# Altium schematic sheet 0_architecture.schdoc: Hardware Archictecture
size A4; Revision: v0.1; SheetNumber: 0; SheetTotal: 6; Designed by: André M. P. Mattos; Version: v0.1
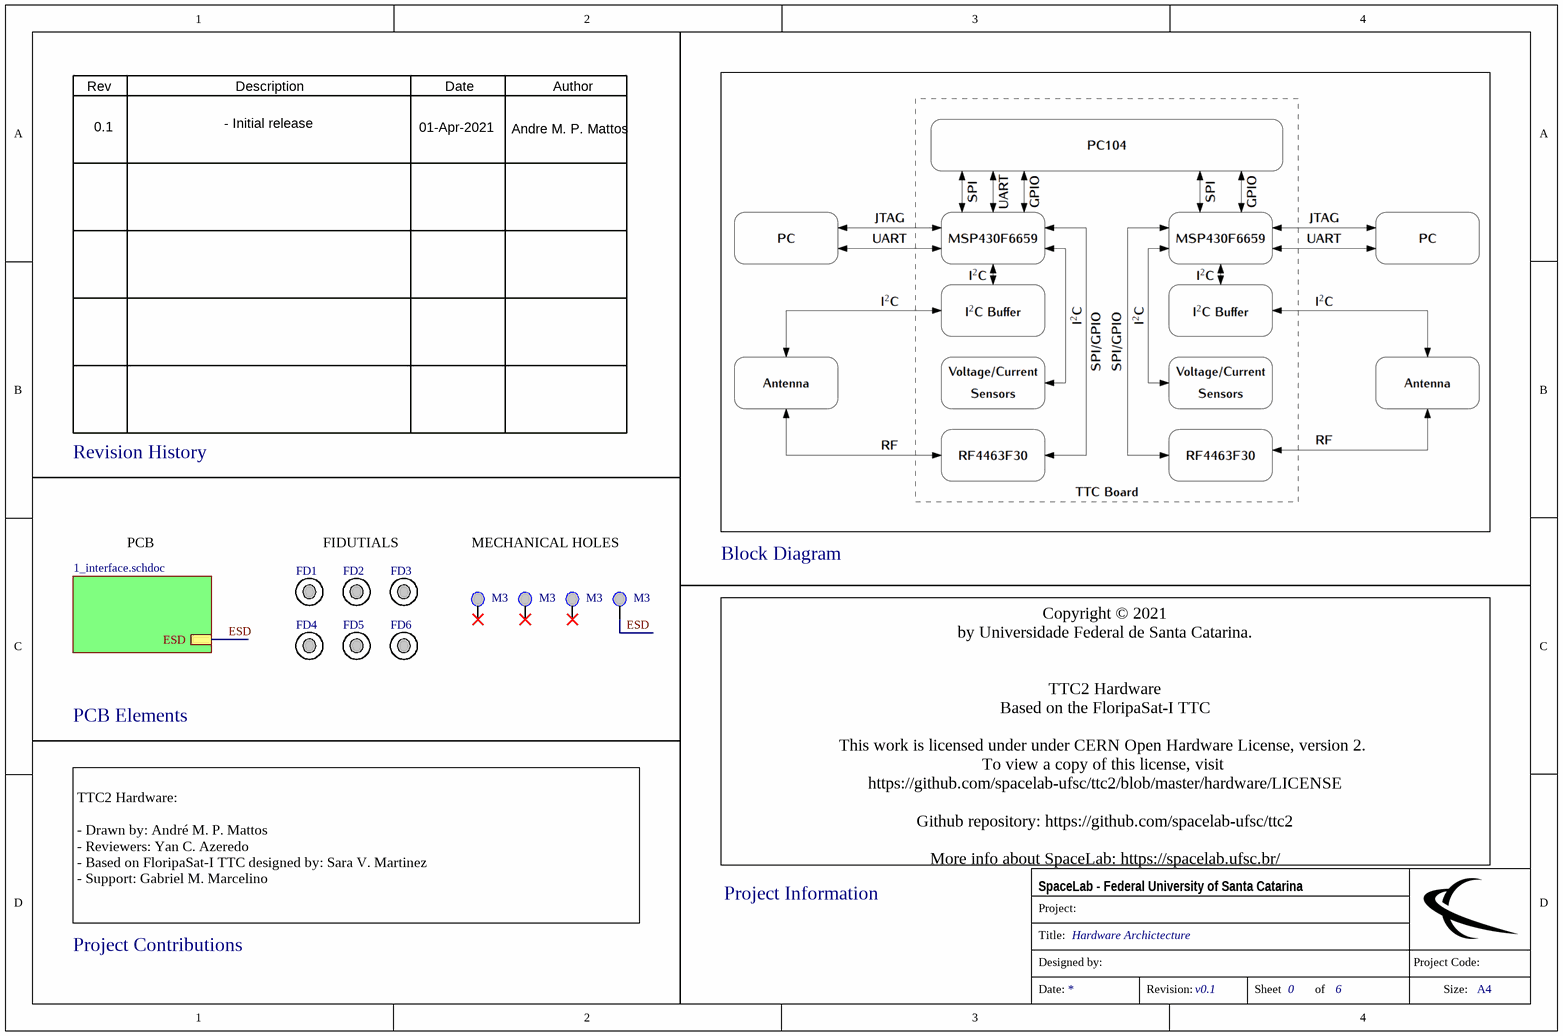
[diagram p0: 0_architecture.schdoc]

## Parts
FD1  Fiducial 1.3  [Fiducial 1.3mm]  (value not drawn)  (no BOM)
FD2  Fiducial 1.3  [Fiducial 1.3mm]  (value not drawn)  (no BOM)
FD3  Fiducial 1.3  [Fiducial 1.3mm]  (value not drawn)  (no BOM)
FD4  Fiducial 1.3  [Fiducial 1.3mm]  (value not drawn)  (no BOM)
FD5  Fiducial 1.3  [Fiducial 1.3mm]  (value not drawn)  (no BOM)
FD6  Fiducial 1.3  [Fiducial 1.3mm]  (value not drawn)  (no BOM)
MEC1  M3  [M3 hole]  (no BOM)
MEC2  M3  [M3 hole]  (no BOM)
MEC3  M3  [M3 hole]  (no BOM)
MEC4  M3  [M3 hole]  (no BOM)

## Sub-sheets
Interface = 1_interface.schdoc: ESD

## Nets
ESD: MEC4.0 ; sheet Interface/ESD

Not connected (* = marked no-connect by the designer): MEC1 0*; MEC2 0*; MEC3 0*

## Notes on the sheet
- Rev
- Description
- Date
- Author
- 0.1
- - Initial release
- 01-Apr-2021
- Andre M. P. Mattos
- Revision History
- PCB
- FIDUTIALS
- MECHANICAL HOLES
- Block Diagram
- PCB Elements
- TTC2 Hardware:
  - Drawn by: André M. P. Mattos
  - Reviewers: Yan C. Azeredo
  - Based on FloripaSat-I TTC designed by: Sara V. Martinez
  - Support: Gabriel M. Marcelino
- Copyright © 2021
  by Universidade Federal de Santa Catarina.
  TTC2 Hardware
  Based on the FloripaSat-I TTC
  This work is licensed under under CERN Open Hardware License, version 2.
  To view a copy of this license, visit
  https://github.com/spacelab-ufsc/ttc2/blob/master/hardware/LICENSE
  Github repository: https://github.com/spacelab-ufsc/ttc2
  More info about SpaceLab: https://spacelab.ufsc.br/
- Project Information
- Project Contributions
- Project:
- SpaceLab - Federal University of Santa Catarina
- Title:
- Designed by:
- Project Code:
- Date:
- Revision:
- Sheet
- of
- Size:
- A4

## Library data of the parts
FD1-FD6 = Fiducial 1.3: Fiducial 1.3mm
MEC1-MEC4 = M3 hole